# EAGLE schematic Shield (EAGLE 9.6.2)
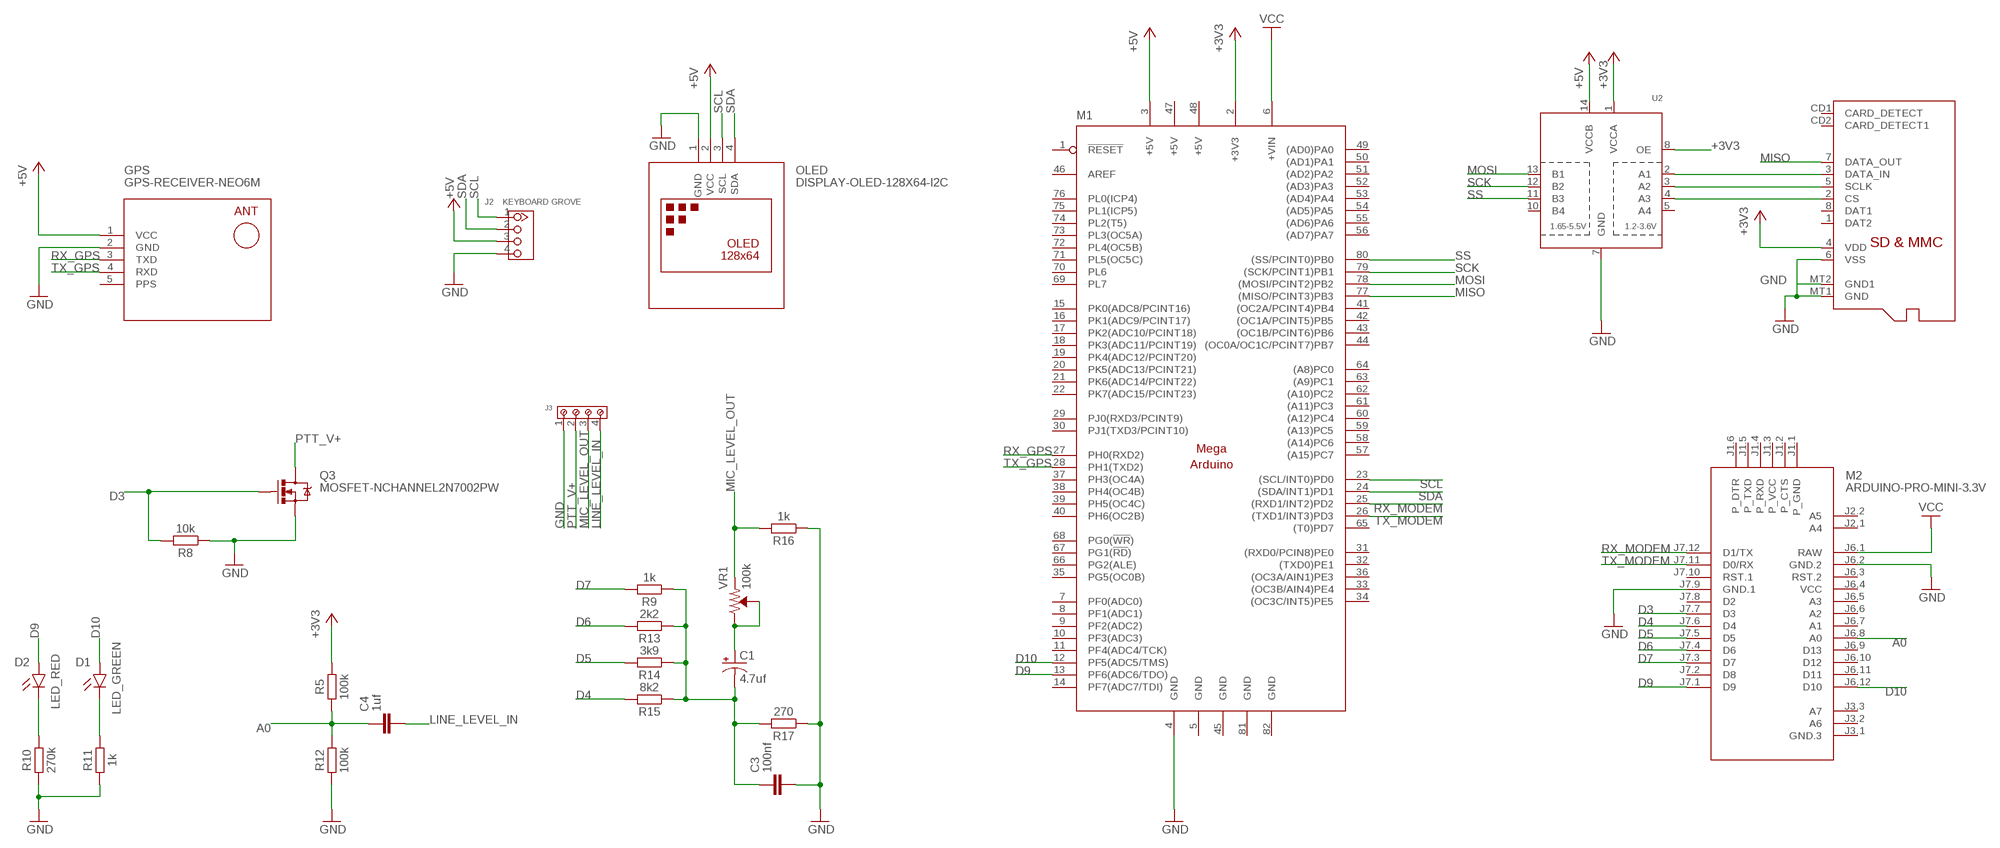
[diagram p0: schematic, sheet 1]

## Parts
C1  4.7uf  CPOL-USCT3528  [CT3528]
C3  100nf  C_CHIP-0805(2012-METRIC)  [CAPC2012X110]
C4  1uf  C_CHIP-0805(2012-METRIC)  [CAPC2012X110]
D1  LED_GREEN  CHIP-ROUND-R_0805  [LEDC2012X105N_RND-R]
D2  LED_RED  CHIP-ROUND-R_0805  [LEDC2012X105N_RND-R]
GPS  GPS-RECEIVER-NEO6M  [GPS-RECEIVER-NEO6M]
J2  KEYBOARD GROVE  GROVE-CONNECTOR-DIP-90D(4P-2.0)  [HW4-2.0-90D]
J3  691210910004  [691210910004]
M1  MEGAARDUINO_1  [MEGA_ARDUINO]
M2  ARDUINO-PRO-MINI-3.3V  [ARDUINO-PRO-MINI]
OLED  DISPLAY-OLED-128X64-I2C  [DISPLAY-OLED-128X64-I2C]
Q3  MOSFET-NCHANNEL2N7002PW  [SOT323]
R5  100k  R_CHIP-0805(2012-METRIC)  [RESC2012X65]
R8  10k  R_CHIP-0805(2012-METRIC)  [RESC2012X65]
R9  1k  R_CHIP-0805(2012-METRIC)  [RESC2012X65]
R10  270k  R_CHIP-0805(2012-METRIC)  [RESC2012X65]
R11  1k  R_CHIP-0805(2012-METRIC)  [RESC2012X65]
R12  100k  R_CHIP-0805(2012-METRIC)  [RESC2012X65]
R13  2k2  R_CHIP-0805(2012-METRIC)  [RESC2012X65]
R14  3k9  R_CHIP-0805(2012-METRIC)  [RESC2012X65]
R15  8k2  R_CHIP-0805(2012-METRIC)  [RESC2012X65]
R16  1k  R_CHIP-0805(2012-METRIC)  [RESC2012X65]
R17  270  R_CHIP-0805(2012-METRIC)  [RESC2012X65]
SD  MICROSD  [MICROSD]
U2  TXB0104PWR  [TSSOP14]
VR1  100k  TRIMPOT-SMD-3MM-CLOSED-1/8W-20%  [TRIMPOT-SMD-3MM-CLOSED]

## Nets
+3V3: M1.2(+3V3) R5.2 SD.4(VDD) U2.1(VCCA) U2.8(OE)
+5V: GPS.1(VCC) J2.3 M1.3(+5V) OLED.2(VCC) U2.14(VCCB)
A0: C4.1 M2.J6.8(A0) R5.1 R12.2
D3: M2.J7.7(D3) Q3.1(G) R8.2
D4: M2.J7.6(D4) R15.2
D5: M2.J7.5(D5) R14.2
D6: M2.J7.4(D6) R13.2
D7: M2.J7.3(D7) R9.2
D9: D2.A M1.13(PF6(ADC6/TDO)) M2.J7.1(D9)
D10: D1.A M1.12(PF5(ADC5/TMS)) M2.J6.12(D10)
GND: C3.2 GPS.2(GND) J2.4 J3.1 M1.4(GND) M2.J6.2(GND.2) M2.J7.9(GND.1) OLED.1(GND) Q3.2(S) R8.1 R10.1 R11.1 R12.1 R16.1 R17.1 SD.6(VSS) SD.MT1(GND) SD.MT2(GND1) U2.7(GND)
LINE_LEVEL_IN: C4.2 J3.4
LINE_LEVEL_OUT: C1.+ VR1.2(WIPER) VR1.3(CW)
MIC_LEVEL_OUT: J3.3 R16.2 VR1.1(CCW)
MISO: M1.77((MISO/PCINT3)PB3) SD.7(DATA_OUT)
MOSI: M1.78((MOSI/PCINT2)PB2) U2.13(B1)
N$1: SD.3(DATA_IN) U2.2(A1)
N$2: C1.- C3.1 R9.1 R13.1 R14.1 R15.1 R17.2
N$3: D2.C R10.2
N$4: D1.C R11.2
N$5: SD.5(SCLK) U2.3(A2)
N$6: SD.2(CS) U2.4(A3)
PTT_V+: J3.2 Q3.3(D)
RX_GPS: GPS.3(TXD) M1.27(PH0(RXD2))
RX_MODEM: M1.25((RXD1/INT2)PD2) M2.J7.12(D1/TX)
SCK: M1.79((SCK/PCINT1)PB1) U2.12(B2)
SCL: J2.1 M1.23((SCL/INT0)PD0) OLED.3(SCL)
SDA: J2.2 M1.24((SDA/INT1)PD1) OLED.4(SDA)
SS: M1.80((SS/PCINT0)PB0) U2.11(B3)
TX_GPS: GPS.4(RXD) M1.28(PH1(TXD2))
TX_MODEM: M1.26((TXD1/INT3)PD3) M2.J7.11(D0/RX)
VCC: M1.6(+VIN) M2.J6.1(RAW)
Unconnected: M1.1(!RESET) M1.7(PF0(ADC0)) M1.8(PF1(ADC1)) M1.9(PF2(ADC2)) M1.10(PF3(ADC3)) M1.11(PF4(ADC4/TCK)) M1.14(PF7(ADC7/TDI)) M1.15(PK0(ADC8/PCINT16)) M1.16(PK1(ADC9/PCINT17)) M1.17(PK2(ADC10/PCINT18)) M1.18(PK3(ADC11/PCINT19)) M1.19(PK4(ADC12/PCINT20)) M1.20(PK5(ADC13/PCINT21)) M1.21(PK6(ADC14/PCINT22)) M1.22(PK7(ADC15/PCINT23)) M1.29(PJ0(RXD3/PCINT9)) M1.30(PJ1(TXD3/PCINT10)) M1.31((RXD0/PCIN8)PE0) M1.32((TXD0)PE1) M1.33((OC3B/AIN4)PE4) M1.34((OC3C/INT5)PE5) M1.35(PG5(OC0B)) M1.36((OC3A/AIN1)PE3) M1.37(PH3(OC4A)) M1.38(PH4(OC4B)) M1.39(PH5(OC4C)) M1.40(PH6(OC2B)) M1.41((OC2A/PCINT4)PB4) M1.42((OC1A/PCINT5)PB5) M1.43((OC1B/PCINT6)PB6) M1.44((OC0A/OC1C/PCINT7)PB7) M1.46(AREF) M1.49((AD0)PA0) M1.50((AD1)PA1) M1.51((AD2)PA2) M1.52((AD3)PA3) M1.53((AD4)PA4) M1.54((AD5)PA5) M1.55((AD6)PA6) M1.56((AD7)PA7) M1.57((A15)PC7) M1.58((A14)PC6) M1.59((A13)PC5) M1.60((A12)PC4) M1.61((A11)PC3) M1.62((A10)PC2) M1.63((A9)PC1) M1.64((A8)PC0) M1.65((T0)PD7) M1.66(PG2(ALE)) M1.67(PG1(!RD!)) M1.68(PG0(!WR!)) M1.69(PL7) M1.70(PL6) M1.71(PL5(OC5C)) M1.72(PL4(OC5B)) M1.73(PL3(OC5A)) M1.74(PL2(T5)) M1.75(PL1(ICP5)) M1.76(PL0(ICP4)) M2.J1.1(P_GND) M2.J1.2(P_CTS) M2.J1.3(P_VCC) M2.J1.4(P_RXD) M2.J1.5(P_TXD) M2.J1.6(P_DTR) M2.J2.1(A4) M2.J2.2(A5) M2.J3.1(GND.3) M2.J3.2(A6) M2.J3.3(A7) M2.J6.3(RST.2) M2.J6.5(A3) M2.J6.6(A2) M2.J6.7(A1) M2.J6.9(D13) M2.J6.10(D12) M2.J6.11(D11) M2.J7.2(D8) M2.J7.8(D2) M2.J7.10(RST.1) SD.1(DAT2) SD.8(DAT1) SD.CD1(CARD_DETECT) SD.CD2(CARD_DETECT1) U2.5(A4) U2.10(B4)

## Power pins joined to a net without a drawn wire
+5V: M1.47(+5V) M1.48(+5V)
GND: M1.5(GND) M1.45(GND) M1.81(GND) M1.82(GND)
PPS: GPS.5(PPS)
VCC: M2.J6.4(VCC)

## Library data of the parts
C1 = adafruit:CPOL-US: POLARIZED CAPACITOR, American symbol
C3 C4 = Capacitor:C: Capacitor - Generic; CATEGORY: Capacitor
D1 = LED:CHIP-ROUND-R: LED - Generic; CATEGORY: LED; COLOR: RED; DESCRIPTION: CHIP LED ROUND; SUB-CATEGORY: CHIP; TYPE: ROUND_TOP; VALUE: LED_RED
D2 = LED:CHIP-ROUND-R: LED - Generic; CATEGORY: LED; COLOR: RED; DESCRIPTION: CHIP LED ROUND; SUB-CATEGORY: CHIP; TYPE: ROUND_TOP
GPS = diy-modules:GPS-RECEIVER-NEO6M: GPS Receiver Module based on NEO-6 device Short tutorial how to use NEO-6 module with Arduino: http://www.xarg.org/2016/06/neo6mv2-gps-module-with-arduino/ NEO-6 datasheet is available here: https://www.u-blox.com/sites/default/files/products/documents/NEO-6_DataSheet_%28GPS.G6-HW-09005%29.pdf Click here to find device on ebay.com <http://www.ebay.com/sch/gyneo6mv2>
J2 = OPL_Connector:GROVE-CONNECTOR-DIP-90D(4P-2.0): 320110034; VALUE: 4P-2.0-90D
J3 = Wurth_Connectors_WR-TBL Rising Cage Clamp:691210910004: WR-TBL Serie 2109 - 2.54 mm Horiz. Entry KIND PROPERTIES Pitch 2.54 mm MATERIAL PROPERTIES Insulator Material PA66 Insulator Flammability Rating UL94 V-0 Insulator Color Green Contact Material Brass Contact Plating Copper over Zinc Terminal Screw Material Steel Terminal Screw Plating Zinc Wire Guard Material Brass GENERAL INFORMATION Operating Temperature -40 up to +105 °C Compliance Lead free / RoHS ELECTRICAL PROPERTIES IR cULus 6 A Working Voltage [cULus] 150 V (AC) Withstanding Voltage [cULus] 1300 V (AC) Contact Resistance [cULus] 20 mΩ MECHANICAL PROPERTIES Wire Strip Length 4 up to 5 (mm) Screw M1.6 Solid Wire Section (AWG) 30 to 18 (AWG) Solid Wire Section (Metric) 0.0509 to 0.823 (mm²) Stranded Wire Section (AWG) 30 to 18 (AWG) Stranded Wire Section (Metric) 0.0509 to 0.823 (mm²) CERTIFICATION cULus Approval E315414 PACKAGING PROPERTIES Packaging Box <https://katalog.we-online.com/media/images/v2/o33231v209%20Family_WR-TBL_69121091000x.jpg> Details see: https://katalog.we-online.com/en/em/TBL_2_54_2109_HORIZONTAL_ENTRY_69121091000X Updated by Ella Wu 2019-11-12 2019(C) Wurth Elektronik; DATASHEET-URL: https://www.we-online.com/catalog/datasheet/691210910004.pdf; IR-UL: 6A; MOUNT: THT; PART-NUMBER: 691210910004; PINS: 4; PITCH: 2.54mm; TYPE: Horizontal; WIRE: 30 to 18 (AWG) 0.0509 to 0.823 (mm²); WORKING-VOLTAGE-UL: 150V (AC)
M1 = arduino:MEGAARDUINO_1: The Arduino Mega is a microcontroller board based on the ATmega1280. - 54 digital input/output pins (of which 14 can be used as PWM outputs) - 16 analog inputs - 4 UARTs (hardware serial ports) - 16 MHz crystal oscillator - USB connection - power jack - ICSP header - reset button It contains everything needed to support the microcontroller; simply connect it to a computer with a USB cable or power it with a AC-to-DC adapter or battery to get started. The Mega is compatible with most shields designed for the Arduino Duemilanove or Diecimila. http://arduino.cc/en/Main/ArduinoBoardMega
M2 = diy-modules:ARDUINO-PRO-MINI-*: Arduino Pro Mini and compatible devices More details available here: https://www.arduino.cc/en/Main/ArduinoBoardProMini Click here to find device on ebay.com <http://www.ebay.com/sch/arduino+pro+mini>
OLED = diy-modules:DISPLAY-OLED-128X64-I2C: 128x64 Dot Matrix OLED Module based on SSD1306 chip Variant with I2C interface More details available here: http://www.instructables.com/id/Monochrome-096-i2c-OLED-display-with-arduino-SSD13/ SSD1306 datasheet: https://cdn-shop.adafruit.com/datasheets/SSD1306.pdf Click here to find device on ebay.com <http://www.ebay.com/sch/oled+display+128x64+iic> Note: There are two variants: I2C and SPI. Search for the proper version.
Q3 = BeagleBone_Blue_R3:MOSFET-NCHANNEL: Common NMOSFET Parts MFG P/N Store ID Prod ID FDD8780 TRANS-09984 SI7820DN TRANS-11055 FDS6630A IC-08089 2N7002PW TRANS-11151 FQP30N06L COM-10213 TRANS-10060 BSS123LT1G TRANS-08345 BSS138 TRANS-00830 BS170 2N7000; PROD_ID: TRANS-11151
R5 R8-R17 = Resistor:R: Resistor Fixed - Generic; CATEGORY: Resistor; SUB-CATEGORY: Fixed
SD = adafruit:MICROSD: Micro-SD / Transflash card holder with SPI pinout For the 3M # 2908-05WB-MG and/or 4UCON #19656 push-push type
U2 = adafruit:TXB0104PWR: 4-Bit Bi-Directional Level Shifter 1.2V-3.6V (VCCA) to 1.65V-5.5V (VCCB) bi-directional level shifter with auto direction sensing. Max data rate - VCCA 1.8V: 20Mbps (50ns), VCCA 3.3V: 100Mbps (10ns) Digikey: 296-21929-1-ND
VR1 = SparkFun-Resistors:TRIMPOT: Trimming Potentiometer (Trimpot) Three-terminal potentiometers, with an adjustable wiper and two adjustable resistors. A pot can be used to create a configurable voltage divider, or as a variable resistor. "Trimpots" are a subset of potentiometers, usually intended for "set-and-forget" applications. They're often more delicate than standard potentiometers - rated for fewer turns. Variants PTH-KNOB - PTH Trimpot w/ finger-adjustable knob Trimpot 10K with Knob <https://www.sparkfun.com/products/9806> (COM-09806) Datasheet <http://www.sparkfun.com/datasheets/Components/General/TSR-3386.pdf> SMD-3MM-CLOSED-FRAME - SMD 3mm Square Closed-Frame Trimpot Used on e.g. EasyDriver - Stepper Motor Driver <https://www.sparkfun.com/products/12779> Datasheet <http://www.bitechnologies.com/pdfs/22.pdf> (22AR10KTR) SMD-5MM - SMD 5mm Square Closed-Frame Trimpot Used on e.g. IOIO-OTG - V2.2 <https://www.sparkfun.com/products/13613> Datasheet <http://www.vishay.com/docs/51008/ts53.pdf> (TS53YL502MR10) SMD-3MM-1/10W-25% - 3mm Square Open-Frame Trimpot Used on e.g. SparkFun Shapeoko <https://www.sparkfun.com/products/13899> Datasheet <http://www.bourns.com/docs/Product-Datasheets/TC33.pdf> (TC33X-2-103E); PROD_ID: RES-09285; VALUE: 10k